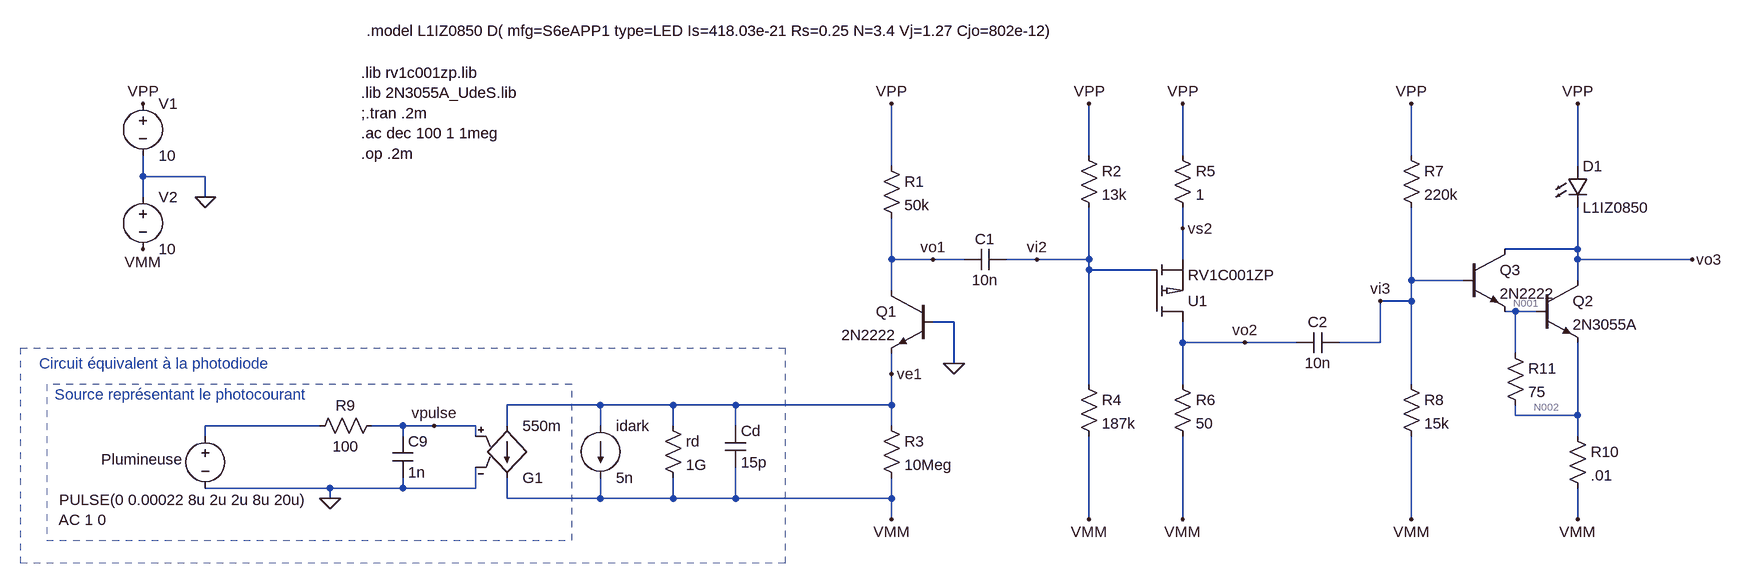
[diagram p0: schematic S6eAPP1_probl_initiale_2025.asc]
S6eAPP1_probl_initiale_2025.asc, the LTspice schematic file:
Version 4
SHEET 1 2260 1556
WIRE 480 32 480 -48
WIRE 624 32 624 -48
WIRE 976 32 976 -48
WIRE 176 48 176 -48
WIRE 1232 48 1232 -48
WIRE -976 64 -976 32
WIRE -880 64 -976 64
WIRE -976 96 -976 64
WIRE -880 96 -880 64
WIRE 624 144 624 112
WIRE 1232 176 1232 112
WIRE 1232 176 1120 176
WIRE 176 192 176 128
WIRE 240 192 176 192
WIRE 288 192 240 192
WIRE 400 192 352 192
WIRE 480 192 480 112
WIRE 480 192 400 192
WIRE 624 192 624 144
WIRE 1232 192 1232 176
WIRE 1408 192 1232 192
WIRE 480 208 480 192
WIRE 576 208 480 208
WIRE 976 224 976 112
WIRE 1056 224 976 224
WIRE 1232 224 1232 192
WIRE 176 240 176 192
WIRE 976 256 976 224
WIRE 976 256 928 256
WIRE 1136 272 1120 272
WIRE 1168 272 1136 272
WIRE 272 288 240 288
WIRE 624 320 624 288
WIRE 720 320 624 320
WIRE 800 320 720 320
WIRE 928 320 928 256
WIRE 928 320 864 320
WIRE 1136 336 1136 272
WIRE 272 352 272 288
WIRE 176 368 176 336
WIRE 480 384 480 208
WIRE 624 384 624 320
WIRE 976 384 976 256
WIRE -272 416 -416 416
WIRE -160 416 -272 416
WIRE -64 416 -160 416
WIRE 176 416 176 368
WIRE 176 416 -64 416
WIRE 1136 432 1136 416
WIRE 1232 432 1232 320
WIRE 1232 432 1136 432
WIRE -704 448 -880 448
WIRE -576 448 -624 448
WIRE -528 448 -576 448
WIRE -464 448 -528 448
WIRE -416 448 -416 416
WIRE -272 448 -272 416
WIRE -160 448 -160 416
WIRE -64 448 -64 416
WIRE 176 448 176 416
WIRE -880 464 -880 448
WIRE -576 464 -576 448
WIRE -464 464 -464 448
WIRE 1232 464 1232 432
WIRE -688 544 -880 544
WIRE -576 544 -576 528
WIRE -576 544 -688 544
WIRE -464 544 -464 512
WIRE -464 544 -576 544
WIRE -688 560 -688 544
WIRE -416 560 -416 528
WIRE -272 560 -272 528
WIRE -272 560 -416 560
WIRE -160 560 -160 528
WIRE -160 560 -272 560
WIRE -64 560 -64 512
WIRE -64 560 -160 560
WIRE 176 560 176 528
WIRE 176 560 -64 560
WIRE 176 592 176 560
WIRE 480 592 480 464
WIRE 624 592 624 464
WIRE 976 592 976 464
WIRE 1232 592 1232 544
FLAG 272 352 0
FLAG 176 -48 VPP
FLAG -976 -48 VPP
FLAG -976 176 VMM
FLAG -880 96 0
FLAG 176 592 VMM
FLAG 240 192 vo1
FLAG 176 368 ve1
FLAG 480 -48 VPP
FLAG 480 592 VMM
FLAG 624 -48 VPP
FLAG 624 592 VMM
FLAG 400 192 vi2
FLAG 720 320 vo2
FLAG 624 144 vs2
FLAG 976 -48 VPP
FLAG 976 592 VMM
FLAG 1232 -48 VPP
FLAG 1232 592 VMM
FLAG 928 256 vi3
FLAG 1408 192 vo3
FLAG -688 560 0
FLAG -528 448 vpulse
SYMBOL /npn 240 240 M0
SYMATTR InstName Q1
SYMATTR Value 2N2222
SYMBOL /res 160 32 R0
SYMATTR InstName R1
SYMATTR Value 50k
SYMBOL /voltage -976 -64 R0
SYMATTR InstName V1
SYMATTR Value 10
SYMBOL /res 160 432 R0
SYMATTR InstName R3
SYMATTR Value 10Meg
SYMBOL /voltage -976 80 R0
SYMATTR InstName V2
SYMATTR Value 10
SYMBOL /current -272 448 R0
SYMATTR InstName idark
SYMATTR Value 5n
SYMBOL /res -176 432 R0
SYMATTR InstName rd
SYMATTR Value 1G
SYMBOL /res 464 16 R0
SYMATTR InstName R2
SYMATTR Value 13k
SYMBOL /res 464 368 R0
SYMATTR InstName R4
SYMATTR Value 187k
SYMBOL /res 608 16 R0
SYMATTR InstName R5
SYMATTR Value 1
SYMBOL /res 608 368 R0
SYMATTR InstName R6
SYMATTR Value 50
SYMBOL /cap 352 176 R90
WINDOW 0 0 32 VBottom 2
WINDOW 3 32 32 VTop 2
SYMATTR InstName C1
SYMATTR Value 10n
SYMBOL /res 960 16 R0
SYMATTR InstName R7
SYMATTR Value 220k
SYMBOL /res 960 368 R0
SYMATTR InstName R8
SYMATTR Value 15k
SYMBOL /res 1216 448 R0
SYMATTR InstName R10
SYMATTR Value .01
SYMBOL /cap -80 448 R0
SYMATTR InstName Cd
SYMATTR Value 15p
SYMBOL LED 1216 48 R0
SYMATTR InstName D1
SYMATTR Value L1IZ0850
SYMBOL npn 1168 224 R0
SYMATTR InstName Q2
SYMATTR Value 2N3055A
SYMBOL /npn 1056 176 R0
SYMATTR InstName Q3
SYMATTR Value 2N2222
SYMBOL /cap 864 304 R90
WINDOW 0 0 32 VBottom 2
WINDOW 3 32 32 VTop 2
SYMATTR InstName C2
SYMATTR Value 10n
SYMBOL g2 -416 544 M180
SYMATTR InstName G1
SYMATTR Value 550m
SYMBOL res -608 432 R90
WINDOW 0 0 56 VBottom 2
WINDOW 3 32 56 VTop 2
SYMATTR InstName R9
SYMATTR Value 100
SYMBOL cap -592 464 R0
SYMATTR InstName C9
SYMATTR Value 1n
SYMBOL voltage -880 448 R0
WINDOW 3 -225 114 Left 2
WINDOW 123 -226 145 Left 2
WINDOW 39 0 0 Left 0
WINDOW 0 -160 52 Left 2
SYMATTR Value PULSE(0 0.00022 8u 2u 2u 8u 20u)
SYMATTR Value2 AC 1 0
SYMATTR InstName Plumineuse
SYMBOL res 1120 320 R0
SYMATTR InstName R11
SYMATTR Value 75
SYMBOL pmos_RV1C001 576 288 M180
SYMATTR InstName U1
TEXT -640 -96 Left 2 !.lib rv1c001zp.lib\n.lib 2N3055A_UdeS.lib\n;.tran .2m\n.ac dec 100 1 1meg\n.op .2m
TEXT -1112 400 Left 2 ;Source représentant le photocourant
TEXT -1136 352 Left 2 ;Circuit équivalent à la photodiode
TEXT -632 -160 Left 2 !.model L1IZ0850 D( mfg=S6eAPP1 type=LED Is=418.03e-21 Rs=0.25 N=3.4 Vj=1.27 Cjo=802e-12)
RECTANGLE Normal -1124 624 -316 384 1
RECTANGLE Normal -1164 328 12 660 1

The netlist it stands for:
* S6eAPP1_probl_initiale_2025.asc
Q1 vo1 0 ve1 0 2N2222
R1 VPP vo1 50k
V1 VPP 0 10
R3 ve1 VMM 10Meg
V2 0 VMM 10
idark ve1 VMM 5n
rd ve1 VMM 1G
R2 VPP vi2 13k
R4 vi2 VMM 187k
R5 VPP vs2 1
R6 vo2 VMM 50
C1 vi2 vo1 10n
R7 VPP vi3 220k
R8 vi3 VMM 15k
R10 N002 VMM .01
Cd ve1 VMM 15p
D1 VPP vo3 L1IZ0850
Q2 vo3 N001 N002 0 2N3055A
Q3 vo3 vi3 N001 0 2N2222
C2 vi3 vo2 10n
G1 ve1 VMM vpulse 0 550m
R9 vpulse N003 100
C9 vpulse 0 1n
V§Plumineuse N003 0 PULSE(0 0.00022 8u 2u 2u 8u 20u) AC 1 0
R11 N001 N002 75
XU1 vo2 vi2 vs2 RV1C001ZP  ; pins D G S
.model D D
.lib standard.dio
.model NPN NPN
.model PNP PNP
.lib standard.bjt
.lib rv1c001zp.lib
.lib 2N3055A_UdeS.lib
;.tran .2m
.ac dec 100 1 1meg
.op .2m
* Source représentant le photocourant
* Circuit équivalent à la photodiode
.model L1IZ0850 D( mfg=S6eAPP1 type=LED Is=418.03e-21 Rs=0.25 N=3.4 Vj=1.27 Cjo=802e-12)
.backanno
.end

* Results of the author's LTspice run, read from the files saved beside the schematic
* Operating Point, zero values left out:
*   V(vo1) = 9.952 V
*   V(ve1) = -473 mV
*   V(vpp) = 10 V
*   V(vmm) = -10 V
*   V(vi2) = 8.7 V
*   V(vs2) = 9.958 V
*   V(vo2) = -7.917 V
*   V(vi3) = -8.987 V
*   V(n002) = -10 V
*   V(vo3) = 6.757 V
*   V(n001) = -9.677 V
*   Ic(Q1) = 962.9 nA
*   Ib(Q1) = 4.369 nA
*   Ie(Q1) = -967.2 nA
*   Ic(Q3) = 4.287 mA
*   Ib(Q3) = 18.75 µA
*   Ie(Q3) = -4.306 mA
*   Ic(Q2) = 1.642 µA
*   Ib(Q2) = 150.1 nA
*   Ie(Q2) = -1.792 µA
*   I(D1) = 4.289 mA
*   I(Idark) = 5 nA
*   I(R1) = 962.9 nA
*   I(R3) = 952.7 nA
*   I(Rd) = 9.527 nA
*   I(R2) = 100 µA
*   I(R4) = 100 µA
*   I(R5) = 41.66 mA
*   I(R6) = 41.66 mA
*   I(R7) = 86.3 µA
*   I(R8) = 67.55 µA
*   I(R10) = 4.307 mA
*   I(R11) = 4.306 mA
*   I(V1) = -46.14 mA
*   I(V2) = -46.14 mA
*   Ix(u1:1) = -41.66 mA
*   Ix(u1:2) = 16.55 pA
*   Ix(u1:3) = 41.66 mA
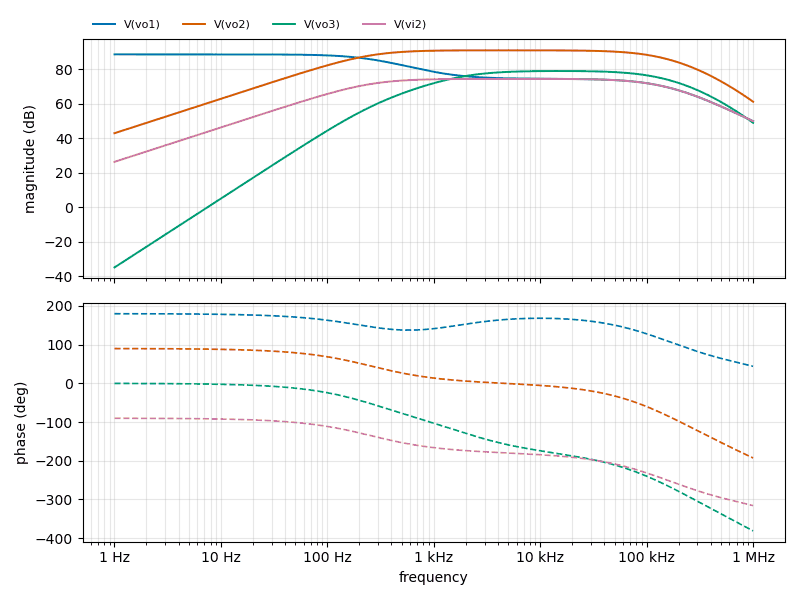
[diagram p1: AC Analysis of S6eAPP1_probl_initiale_2025.asc, plotted from the saved traces]
* AC Analysis, 1 run:
*   V(vo1): 88.72 dB at 1 Hz, 49.98 dB at 1 MHz, peak 88.72 dB at 1 Hz, 3 dB below the peak at 266.4 Hz
*   V(vo2): 42.99 dB at 1 Hz, 61.29 dB at 1 MHz, peak 91.09 dB at 4.467 kHz, 3 dB below the peak at 252.3 Hz and 109 kHz
*   V(vo3): -34.89 dB at 1 Hz, 49.04 dB at 1 MHz, peak 79.08 dB at 15.14 kHz, 3 dB below the peak at 1.95 kHz and 112 kHz
*   V(vi2): 26.38 dB at 1 Hz, 49.97 dB at 1 MHz, peak 74.53 dB at 5.495 kHz, 3 dB below the peak at 254.9 Hz and 112.1 kHz
* From the log:
*   Semiconductor Device Operating Points:
*                           --- Diodes ---
*   Name:      d1        d:u1:1      d:u1:2
*   Model:  l1iz0850     u1:dds      u1:ddg
*   Id:      4.29e-03   -2.59e-11   -1.65e-11
*   Vd:      3.24e+00   -1.79e+01   -1.65e+01
*   Req:     2.05e+01    1.00e+12    1.00e+12
*   CAP:     3.46e-09    2.02e-12    4.06e-13
*                           --- Bipolar Transistors ---
*   Name:       q1          q3          q2
*   Model:    2n2222      2n2222      2n3055a
*   Ib:       4.37e-09    1.87e-05    1.50e-07
*   Ic:       9.63e-07    4.29e-03    1.64e-06
*   Vbe:      4.73e-01    6.90e-01    3.23e-01
*   Vbc:     -9.95e+00   -1.57e+01   -1.64e+01
*   Vce:      1.04e+01    1.64e+01    1.68e+01
*   BetaDC:   2.20e+02    2.29e+02    1.09e+01
*   Gm:       3.72e-05    1.64e-01    6.33e-05
*   Rpi:      5.91e+06    1.38e+03    2.37e+05
*   Rx:       1.00e+01    1.00e+01    3.00e+00
*   Ro:       1.14e+08    2.70e+04    4.06e+07
*   Cbe:      3.42e-11    1.06e-10    6.73e-10
*   Cbc:      3.33e-12    2.89e-12    6.06e-11
*   Cjs:      0.00e+00    0.00e+00    0.00e+00
*   BetaAC:   2.20e+02    2.26e+02    1.50e+01
*   Cbx:      0.00e+00    0.00e+00    0.00e+00
*   Ft:       1.58e+05    2.40e+08    1.37e+04
*                           --- MOSFET Transistors ---
*   Name:        m:u1:1
*   Model:      u1:mos_p
*   Id:         -4.17e-02
*   Vgs:        -1.26e+00
*   Vds:        -1.78e+01
*   Vbs:         0.00e+00
*   Vth:        -8.05e-01
*   Vdsat:      -4.61e-01
*   Gm:          1.65e-01
*   Gds:         9.72e-04
*   Gmb:         2.88e-02
*   Cbd:         0.00e+00
*   Cbs:         0.00e+00
*   Cgsov:       1.00e-11
*   Cgdov:       1.00e-12
*   Cgbov:       0.00e+00
*   Cgs:         2.30e-12
*   Cgd:         0.00e+00
*   Cgb:         0.00e+00